# Altium schematic sheet MOTAS_sch.SchDoc
size A4
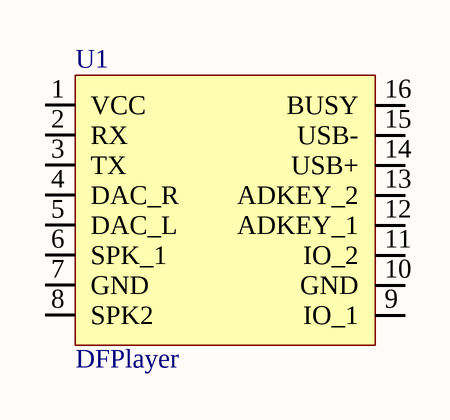
[diagram p0: MOTAS_sch.SchDoc]

## Parts
U1  DFPlayer

## Nets

Not connected (* = marked no-connect by the designer): U1 1(VCC) 2(RX) 3(TX) 4(DAC_R) 5(DAC_L) 6(SPK_1) 7(GND) 8(SPK2) 9(IO_1) 10(GND) 11(IO_2) 12(ADKEY_1) 13(ADKEY_2) 14(USB+) 15(USB-) 16(BUSY)